# Altium schematic sheet 3.RFID.SchDoc: RFID
size A3; DrawnBy: AYTAC DILEK; SheetNumber: 3; SheetTotal: 16
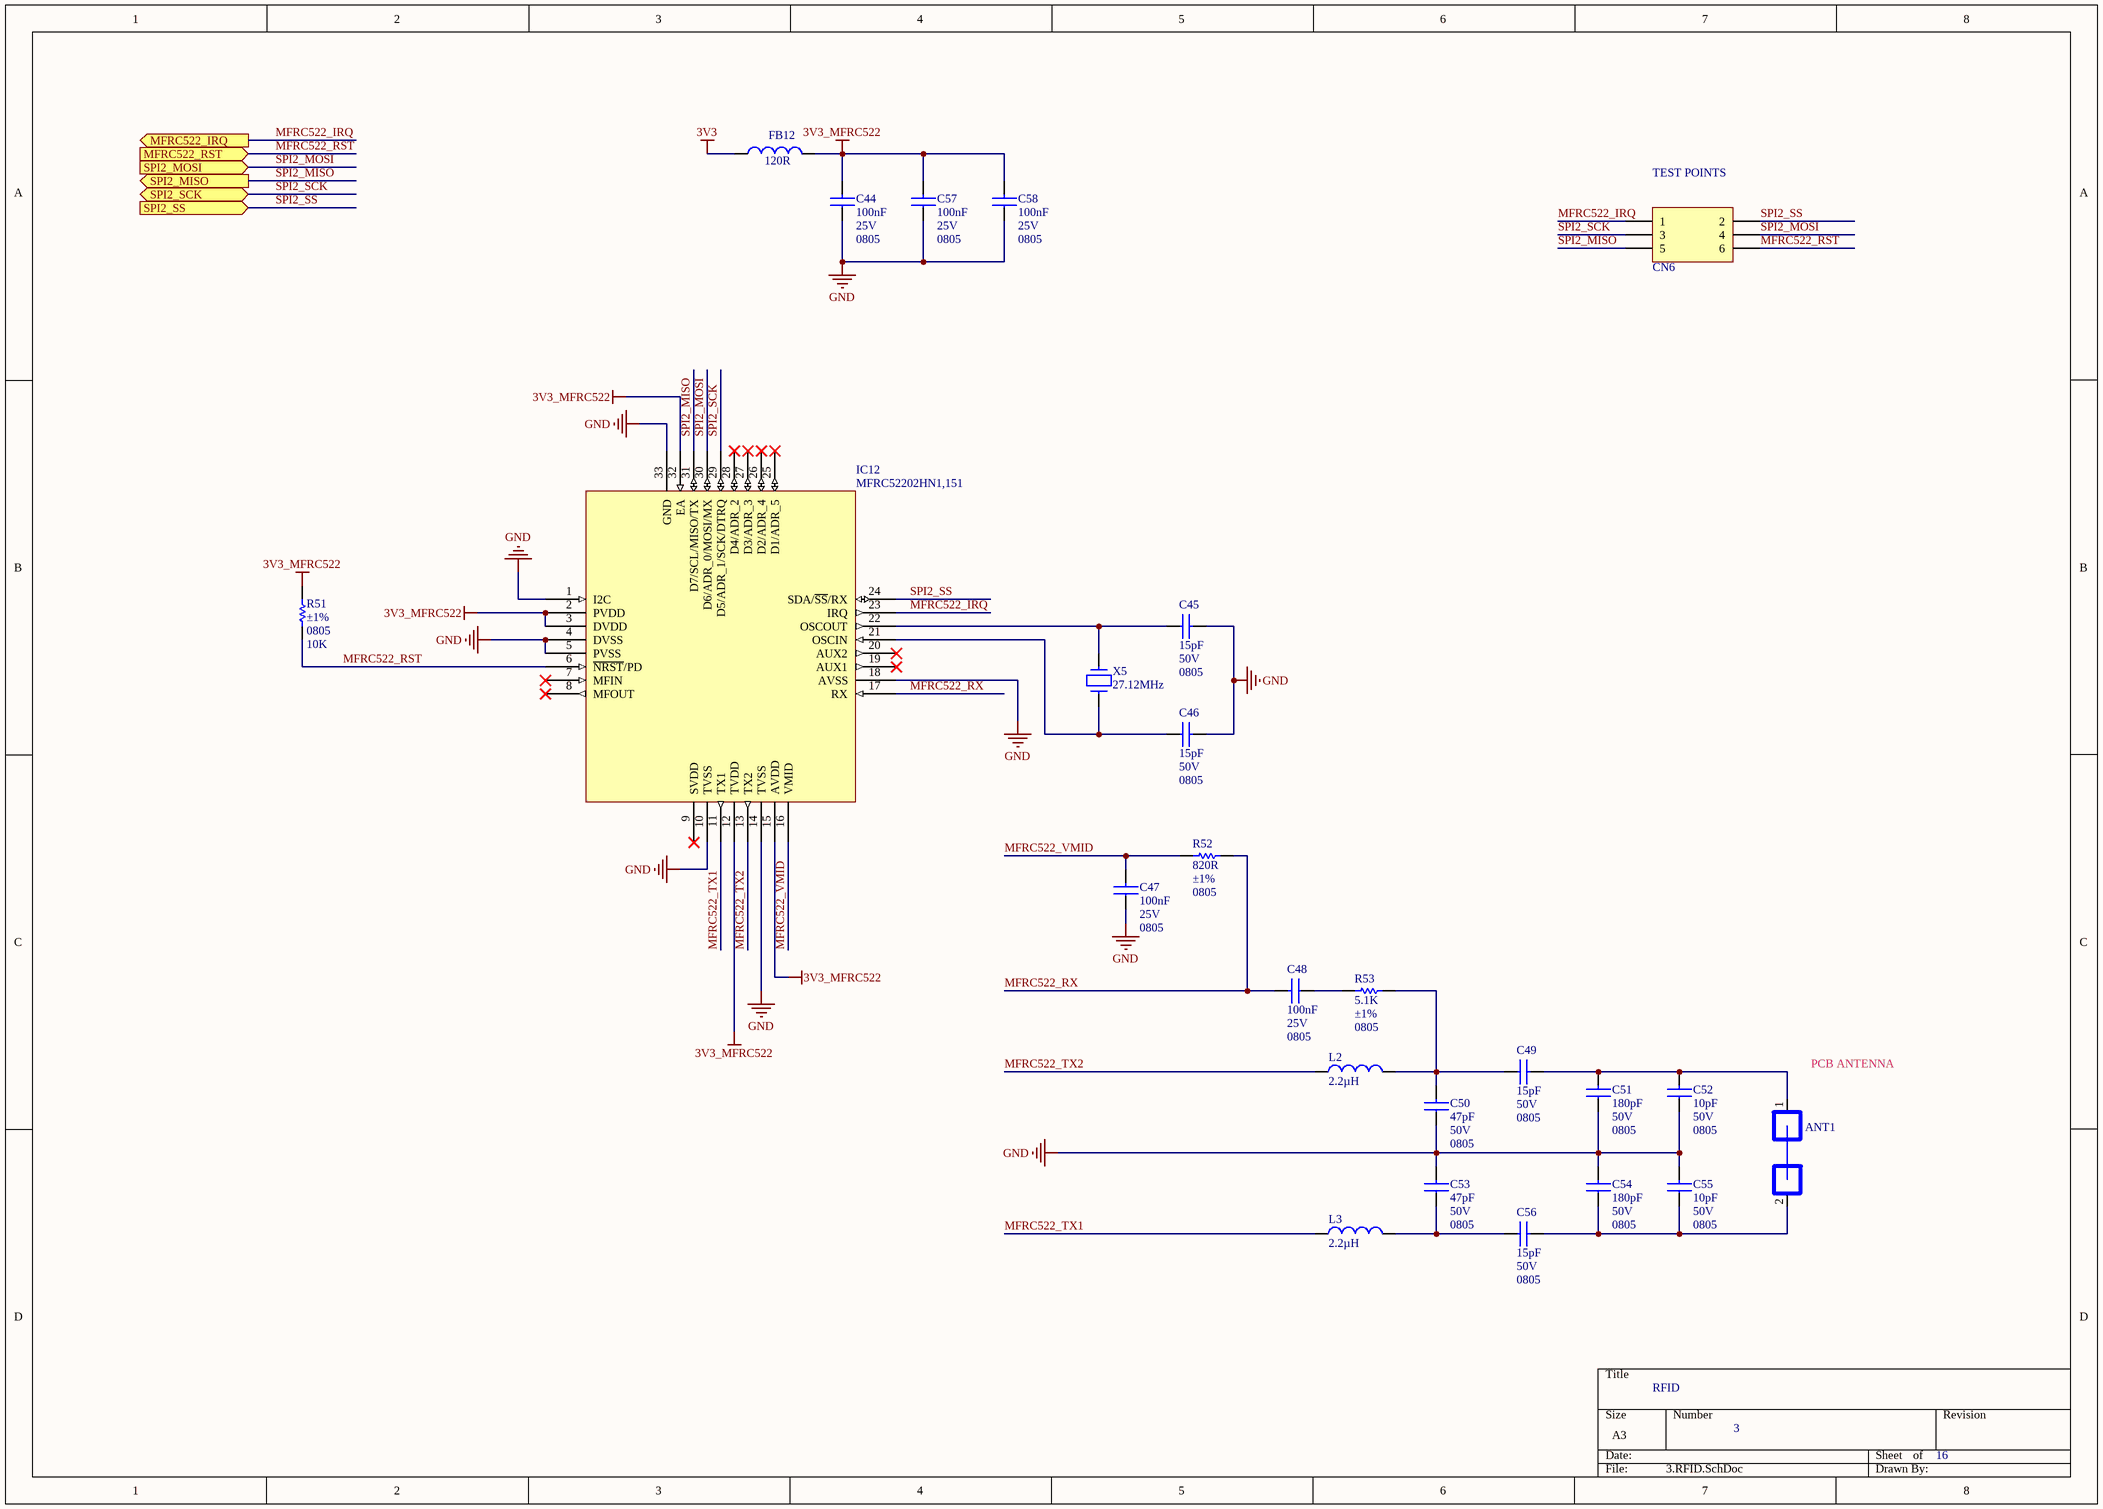
[diagram p0: 3.RFID.SchDoc]

## Parts
ANT1  COIL_ANTENNA_PAD  [COIL_ANTENNA_PAD]  (value not drawn)
C44  Capacitance: 100nF  Voltage - Rated: 25V  Package / Case: 0805  [CAPC2012X100N_EIA0805]  (hidden comment: CAP_NP)
C45  Capacitance: 15pF  Voltage - Rated: 50V  Package / Case: 0805  [CAPC2012X100N_EIA0805]  (hidden comment: CAP_NP)
C46  Capacitance: 15pF  Voltage - Rated: 50V  Package / Case: 0805  [CAPC2012X100N_EIA0805]  (hidden comment: CAP_NP)
C47  Capacitance: 100nF  Voltage - Rated: 25V  Package / Case: 0805  [CAPC2012X100N_EIA0805]  (hidden comment: CAP_NP)
C48  Capacitance: 100nF  Voltage - Rated: 25V  Package / Case: 0805  [CAPC2012X100N_EIA0805]  (hidden comment: CAP_NP)
C49  Capacitance: 15pF  Voltage - Rated: 50V  Package / Case: 0805  [CAPC2012X100N_EIA0805]  (hidden comment: CAP_NP)
C50  Capacitance: 47pF  Voltage - Rated: 50V  Package / Case: 0805  [CAPC2012X100N_EIA0805]  (hidden comment: CAP_NP)
C51  Capacitance: 180pF  Voltage - Rated: 50V  Package / Case: 0805  [CAPC2012X100N_EIA0805]  (hidden comment: CAP_NP)
C52  Capacitance: 10pF  Voltage - Rated: 50V  Package / Case: 0805  [CAPC2012X100N_EIA0805]  (hidden comment: CAP_NP)
C53  Capacitance: 47pF  Voltage - Rated: 50V  Package / Case: 0805  [CAPC2012X100N_EIA0805]  (hidden comment: CAP_NP)
C54  Capacitance: 180pF  Voltage - Rated: 50V  Package / Case: 0805  [CAPC2012X100N_EIA0805]  (hidden comment: CAP_NP)
C55  Capacitance: 10pF  Voltage - Rated: 50V  Package / Case: 0805  [CAPC2012X100N_EIA0805]  (hidden comment: CAP_NP)
C56  Capacitance: 15pF  Voltage - Rated: 50V  Package / Case: 0805  [CAPC2012X100N_EIA0805]  (hidden comment: CAP_NP)
C57  Capacitance: 100nF  Voltage - Rated: 25V  Package / Case: 0805  [CAPC2012X100N_EIA0805]  (hidden comment: CAP_NP)
C58  Capacitance: 100nF  Voltage - Rated: 25V  Package / Case: 0805  [CAPC2012X100N_EIA0805]  (hidden comment: CAP_NP)
CN6  HDR_2X3  [HDRV6W64P254_2X3_762X508X600P]  (value not drawn)
FB12  Impedance: 120R  [FILC2012X100N_EIA0805]  (hidden comment: BEAD)
IC12  Manufacturer Part Number: MFRC52202HN1,151  [QFN50P500X500X100_HS-33N_[NXP]SOT617-1]  (hidden comment: MFRC522)
L2  Inductance: 2.2µH  [INDC2115X13N_EIA0805]  (hidden comment: INDUCTOR)
L3  Inductance: 2.2µH  [INDC2115X13N_EIA0805]  (hidden comment: INDUCTOR)
R51  Tolerance: ±1%  Package / Case: 0805  Resistance (Ohm): 10K  [RESC2013X65N_EIA0805]  (hidden comment: RES)
R52  value 820R  Tolerance: ±1%  Package / Case: 0805  [RESC2013X65N_EIA0805]  (hidden comment: RES)
R53  value 5.1K  Tolerance: ±1%  Package / Case: 0805  [RESC2013X65N_EIA0805]  (hidden comment: RES)
X5  value 27.12MHz  [HC-49/US]  (hidden comment: CRYSTAL)

## Ports
MFRC522_IRQ (out), MFRC522_RST (in), SPI2_MISO (out), SPI2_MOSI (in), SPI2_SCK (bidir), SPI2_SS (in)

## Nets
3V3: FB12.1
3V3_MFRC522: C44.2 C57.2 C58.2 FB12.2 IC12.2(PVDD) IC12.3(DVDD) IC12.12(TVDD) IC12.15(AVDD) IC12.32(EA) R51.1
GND: C44.1 C45.2 C46.2 C47.1 C50.1 C51.1 C52.1 C53.2 C54.2 C55.2 C57.1 C58.1 IC12.1(I2C) IC12.4(DVSS) IC12.5(PVSS) IC12.10(TVSS) IC12.14(TVSS) IC12.18(AVSS) IC12.33(GND)
MFRC522_IRQ: CN6.1 IC12.23(IRQ) ; port MFRC522_IRQ
MFRC522_RST: CN6.6 IC12.6(~{NRST}/PD) R51.2 ; port MFRC522_RST
MFRC522_RX: C48.2 IC12.17(RX) R52.1
MFRC522_TX1: IC12.11(TX1) L3.1
MFRC522_TX2: IC12.13(TX2) L2.1
MFRC522_VMID: C47.2 IC12.16(VMID) R52.2
SPI2_MISO: CN6.5 IC12.31(D7/SCL/MISO/TX) ; port SPI2_MISO
SPI2_MOSI: CN6.4 IC12.30(D6/ADR_0/MOSI/MX) ; port SPI2_MOSI
SPI2_SCK: CN6.3 IC12.29(D5/ADR_1/SCK/DTRQ) ; port SPI2_SCK
SPI2_SS: CN6.2 IC12.24(SDA/~{SS}/RX) ; port SPI2_SS
NetANT1_1: ANT1.1 C49.2 C51.2 C52.2
NetANT1_2: ANT1.2 C54.1 C55.1 C56.2
NetC45_1: C45.1 IC12.22(OSCOUT) X5.1
NetC46_1: C46.1 IC12.21(OSCIN) X5.2
NetC48_1: C48.1 R53.2
NetC49_1: C49.1 C50.2 L2.2 R53.1
NetC53_1: C53.1 C56.1 L3.2

Not connected (* = marked no-connect by the designer): IC12 7(MFIN)* 8(MFOUT)* 9(SVDD)* 19(AUX1)* 20(AUX2)* 25(D1/ADR_5)* 26(D2/ADR_4)* 27(D3/ADR_3)* 28(D4/ADR_2)*

## Notes on the sheet
- (near CN6) TEST POINTS
- PCB ANTENNA

## Library data of the parts
ANT1 = SMSC00008: Coil Antenna Pad; Part Number: SMSC00008; Value: COIL_ANTENNA_PAD
C44 C47 C48 C57 C58 = SCAP00300093: CAP CER 0.1UF 25V X7R 0805; Manufacturer: Samsung Electro-Mechanics America, Inc.; Manufacturer Part Number: CL21B104KACNNNC; Value: 100nF; Tolerance: ±10%; Type: Multi Layer Ceramic Capacitor  (MLCC); Cost x1 ($): 0.10000; Cost x10 ($): 0.03300; Cost x100 ($): 0.01470; Cost x1000 ($): 0.00825; Distrubutor: Digikey; Lead Time: 11 Weeks; Part Number: SCAP00300093; Temperature Coefficient: X7R; Operating Temperature: -55°C ~ 125°C; Mounting Type: Surface Mount, MLCC; Size / Dimension: 0.079" L x 0.049" W (2.00mm x 1.25mm); Category: Capacitors; Family: Ceramic Capacitors; Distributor Part Number: 1276-1099-1-ND; Distributor Link: http://www.digikey.com/product-detail/en/samsung-electro-mechanics-america-inc/CL21B104KACNNNC/1276-1099-1-ND/3889185; ROHS: YES; Moisture Sensitivity Level (MSL): 1 (Unlimited); Quantity: 50
C45 C46 C49 C56 = SCAP00300038: CAP CER 15PF 50V NP0 0805; Manufacturer: Samsung Electro-Mechanics America, Inc.; Manufacturer Part Number: CL21C150JB61PNC; Tolerance: ±5%; Temperature Coefficient: C0G, NP0; Type: Multi Layer Ceramic Capacitor  (MLCC); Cost x1 ($): 0.10000; Cost x10 ($): 0.05100; Cost x100 ($): 0.02250; Cost x1000 ($): 0.01265; Distrubutor: Digikey; Lead Time: 11 Weeks; Part Number: SCAP00300038; Value: 15pF; Operating Temperature: -55°C ~ 125°C; Mounting Type: Surface Mount, MLCC; Size / Dimension: 0.079" L x 0.049" W (2.00mm x 1.25mm); Category: Capacitors; Family: Ceramic Capacitors; Distributor Part Number: 1276-2585-1-ND; Distributor Link: http://www.digikey.com/product-detail/en/samsung-electro-mechanics-america-inc/CL21C150JB61PNC/1276-2585-1-ND/3890671; ROHS: YES; Moisture Sensitivity Level (MSL): 1 (Unlimited); Quantity: 50
C50 C53 = SCAP00300050: CAP CER 47PF 50V NP0 0805; Manufacturer: Samsung Electro-Mechanics America, Inc.; Manufacturer Part Number: CL21C470JBANNNC; Tolerance: ±5%; Temperature Coefficient: C0G, NP0; Type: Multi Layer Ceramic Capacitor  (MLCC); Cost x1 ($): 0.10000; Cost x10 ($): 0.04400; Cost x100 ($): 0.01960; Cost x1000 ($): 0.01100; Distrubutor: Digikey; Lead Time: 14 Weeks; Part Number: SCAP00300050; Value: 47pF; Operating Temperature: -55°C ~ 125°C; Mounting Type: Surface Mount, MLCC; Size / Dimension: 0.079" L x 0.049" W (2.00mm x 1.25mm); Category: Capacitors; Family: Ceramic Capacitors; Distributor Part Number: 1276-1156-1-ND; Distributor Link: http://www.digikey.com/product-detail/en/samsung-electro-mechanics-america-inc/CL21C470JBANNNC/1276-1156-1-ND/3889242; ROHS: YES; Moisture Sensitivity Level (MSL): 1 (Unlimited); Quantity: 50
C51 C54 = SCAP00300064: CAP CER 180PF 50V NP0 0805; Manufacturer: Samsung Electro-Mechanics America, Inc.; Manufacturer Part Number: CL21C181JBANNNC; Tolerance: ±5%; Temperature Coefficient: C0G, NP0; Type: Multi Layer Ceramic Capacitor  (MLCC); Cost x1 ($): 0.10000; Cost x10 ($): 0.05800; Cost x100 ($): 0.02570; Cost x1000 ($): 0.01444; Distrubutor: Digikey; Lead Time: 11 Weeks; Part Number: SCAP00300064; Value: 180pF; Operating Temperature: -55°C ~ 125°C; Mounting Type: Surface Mount, MLCC; Size / Dimension: 0.079" L x 0.049" W (2.00mm x 1.25mm); Category: Capacitors; Family: Ceramic Capacitors; Distributor Part Number: 1276-1129-1-ND; Distributor Link: http://www.digikey.com/product-detail/en/samsung-electro-mechanics-america-inc/CL21C181JBANNNC/1276-1129-1-ND/3889215; ROHS: YES; Moisture Sensitivity Level (MSL): 1 (Unlimited); Quantity: 50
C52 C55 = SCAP00300034: CAP CER 10PF 50V NP0 0805; Manufacturer: Samsung Electro-Mechanics America, Inc.; Manufacturer Part Number: CL21C100CBANNNC; Tolerance: ±0.25pF; Temperature Coefficient: C0G, NP0; Type: Multi Layer Ceramic Capacitor  (MLCC); Cost x1 ($): 0.10000; Cost x10 ($): 0.08000; Cost x100 ($): 0.03760; Cost x1000 ($): 0.02182; Distrubutor: Digikey; Lead Time: 11 Weeks; Part Number: SCAP00300034; Value: 10pF; Operating Temperature: -55°C ~ 125°C; Mounting Type: Surface Mount, MLCC; Size / Dimension: 0.079" L x 0.049" W (2.00mm x 1.25mm); Category: Capacitors; Family: Ceramic Capacitors; Distributor Part Number: 1276-2561-1-ND; Distributor Link: http://www.digikey.com/product-detail/en/samsung-electro-mechanics-america-inc/CL21C100CBANNNC/1276-2561-1-ND/3890647; ROHS: YES; Moisture Sensitivity Level (MSL): 1 (Unlimited); Quantity: 50
CN6 = SCON00128: CONN HEADER FMALE 6PS .1" DL TIN; Manufacturer: Sullins Connector Solutions; Manufacturer Part Number: PPTC032LFBN-RC; Pitch: 2.54mm; Cost x1 ($): 0.80000; Cost x10 ($): 0.62200; Cost x100 ($): 0.47480; Cost x1000 ($): 0.33760; Distrubutor: Digikey; Part Number: SCON00128; Value: HDR_2X3; Category: Connectors, Interconnects; Family: Rectangular Connectors - Headers, Receptacles, Female Sockets; Connector Type: Header; Contact Type: Female Socket; Mounting Type: Through Hole; Distributor Part Number: S7071-ND; Datasheet Link: http://www.digikey.com/product-detail/en/sullins-connector-solutions/PPTC032LFBN-RC/S7071-ND/810210; ROHS: YES; Quantity: 0
FB12 = SFIL00005: FERRITE CHIP POWER 120 OHM SMD; Manufacturer: Laird-Signal Integrity Products; Manufacturer Part Number: HI0805O121R-10; Type: Differential Mode - Single; Current Rating: 3.5A; DC Resistance (DCR): 20 mOhm Max; Cost x10 ($): 0.08700; Cost x100 ($): 0.05230; Cost x1000 ($): 0.03010; Distrubutor: Digikey; Cost x1 ($): 0.10000; Part Number: SFIL00005; Package / Case: 0805 (2012 Metric); Value: BEAD; Category: Filters; Family: Ferrite Beads and Chips; Distributor Part Number: 240-2393-1-ND; ROHS: YES; Datasheet Link: http://www.digikey.com/product-detail/en/HI0805O121R-10/240-2393-1-ND/806753; Quantity: 50
IC12 = SRF000006: IC READER 13.56MHZ 32-HVQFN; Manufacturer: NXP Semiconductors; Voltage - Supply: 2.5 V ~ 3.3 V; Cost x10 ($): 4.37500; Cost x100 ($): 3.58750; Cost x1000 ($): 2.45000; Distrubutor: Digikey; Lead Time: 8 Weeks; Revision Status: OK; Revision By: Aytac Dilek; Cost x1 ($): 4.90000; Part Number: SRF000006; Value: MFRC522; Operating Temperature: -25°C ~ 85°C; Category: RF/IF and RFID; Family: RFID, RF Access, Monitoring Ics; Package / Case: 32-HVQFN (5x5); Type: RFID Reader; Distributor Part Number: 568-8603-ND; ROHS: YES; Part Status: Active; Datasheet Link: http://www.digikey.com/product-detail/en/nxp-semiconductors/MFRC52202HN1,151/568-8603-ND/2606239; Moisture Sensitivity Level (MSL): 1 (Unlimited); Quantity: 0; Revision Date: 09/17/2016
L2 L3 = SIND00007: FIXED IND 2.2UH 1.3A 80 MOHM SMD; Manufacturer: Murata Electronics North America; Manufacturer Part Number: LQM2HPN2R2MG0L; Tolerance: ±20%; DC Resistance (DCR): 100 mOhm Max; Type: Multilayer; Cost x10 ($): 0.30700; Cost x100 ($): 0.22170; Cost x1000 ($): 0.15686; Distrubutor: Digikey; Lead Time: 8 Weeks; Cost x1 ($): 0.34000; Part Number: SIND00007; Value: 2.2uH; Package / Case: 0805 (2012 Metric); Operating Temperature: -55°C ~ 125°C; Current Rating: 1.3A; Category: Inductors, Coils, Chokes; Family: Fixed Inductors; Distributor Part Number: 490-5114-1-ND; Distributor Link: http://www.digikey.com/product-detail/en/murata-electronics-north-america/LQM2HPN2R2MG0L/490-5114-1-ND/1893677; ROHS: YES; Moisture Sensitivity Level (MSL): 1 (Unlimited); Quantity: 100
R51 = SRES03010098: RES SMD 10K OHM 1% 1/8W 0805; Manufacturer: Yageo; Manufacturer Part Number: RC0805FR-0710KL; Power (Watts): 0.125W, 1/8W; Cost x1 ($): 0.10; Cost x10 ($): 0.21; Cost x100 ($): 0.84; Cost x1000 ($): 3.79; Distrubutor: Digikey; Part Number: SRES03010098; Value: 10K; Category: Resistors; Family: Chip Resistor - Surface Mount; Distributor Part Number: 311-10.0KCRCT-ND; Distributor Link: http://www.digikey.com/product-detail/en/RC0805FR-0710KL/311-10.0KCRCT-ND/730482; ROHS: YES; Quantity: 0
R52 = SRES03010072: RES SMD 820 OHM 1% 1/8W 0805; Manufacturer: Yageo; Manufacturer Part Number: RC0805FR-07820RL; Resistance (Ohm): 820; Power (Watts): 0.125W, 1/8W; Cost x1 ($): 0.10; Cost x10 ($): 0.21; Cost x100 ($): 0.84; Cost x1000 ($): 3.79; Distrubutor: Digikey; Part Number: SRES03010072; Category: Resistors; Family: Chip Resistor - Surface Mount; Distributor Part Number: 311-820CRCT-ND; Distributor Link: http://www.digikey.com/product-detail/en/RC0805FR-07820RL/311-820CRCT-ND/731115; ROHS: YES; Quantity: 0
R53 = SRES03010091: RES SMD 5.1K OHM 1% 1/8W 0805; Manufacturer: Yageo; Manufacturer Part Number: RC0805FR-075K1L; Power (Watts): 0.125W, 1/8W; Cost x1 ($): 0.10; Cost x10 ($): 0.21; Cost x100 ($): 0.84; Cost x1000 ($): 3.79; Distrubutor: Digikey; Part Number: SRES03010091; Resistance (Ohm): 5.1K; Category: Resistors; Family: Chip Resistor - Surface Mount; Distributor Part Number: 311-5.10KCRCT-ND; Distributor Link: http://www.digikey.com/product-detail/en/RC0805FR-075K1L/311-5.10KCRCT-ND/730935; ROHS: YES; Quantity: 0
X5 = SCRY00017: CRYSTAL 27.1200MHZ 18PF SMD; Manufacturer: IQD; Manufacturer Part Number: LFXTAL057488Bulk; Frequency Tolerance: ±20ppm; Load Capacitance: 20pF; ESR: 40 Ohm; Cost x10 ($): 0.538; Cost x100 ($): 0.445; Cost x1000 ($): 0.351; Distrubutor: Mouser; Lead Time: 7 Weeks; Cost x1 ($): 0.604; Part Number: SCRY00017; Mounting Type: Through Hole; Package / Case: HC49/US; Type: MHz Crystal; Distributor Part Number: 449-LFXTAL057488BULK; ROHS: YES; Datasheet Link: http://eu.mouser.com/ProductDetail/IQD/LFXTAL057488Bulk/?qs=sGAEpiMZZMsBj6bBr9Q9aR%2fuGiDjvlIShMBIAlFQovQfY2Fj9uCXUA%3d%3d; Quantity: 50